# EAGLE schematic board (EAGLE 9.6.0)
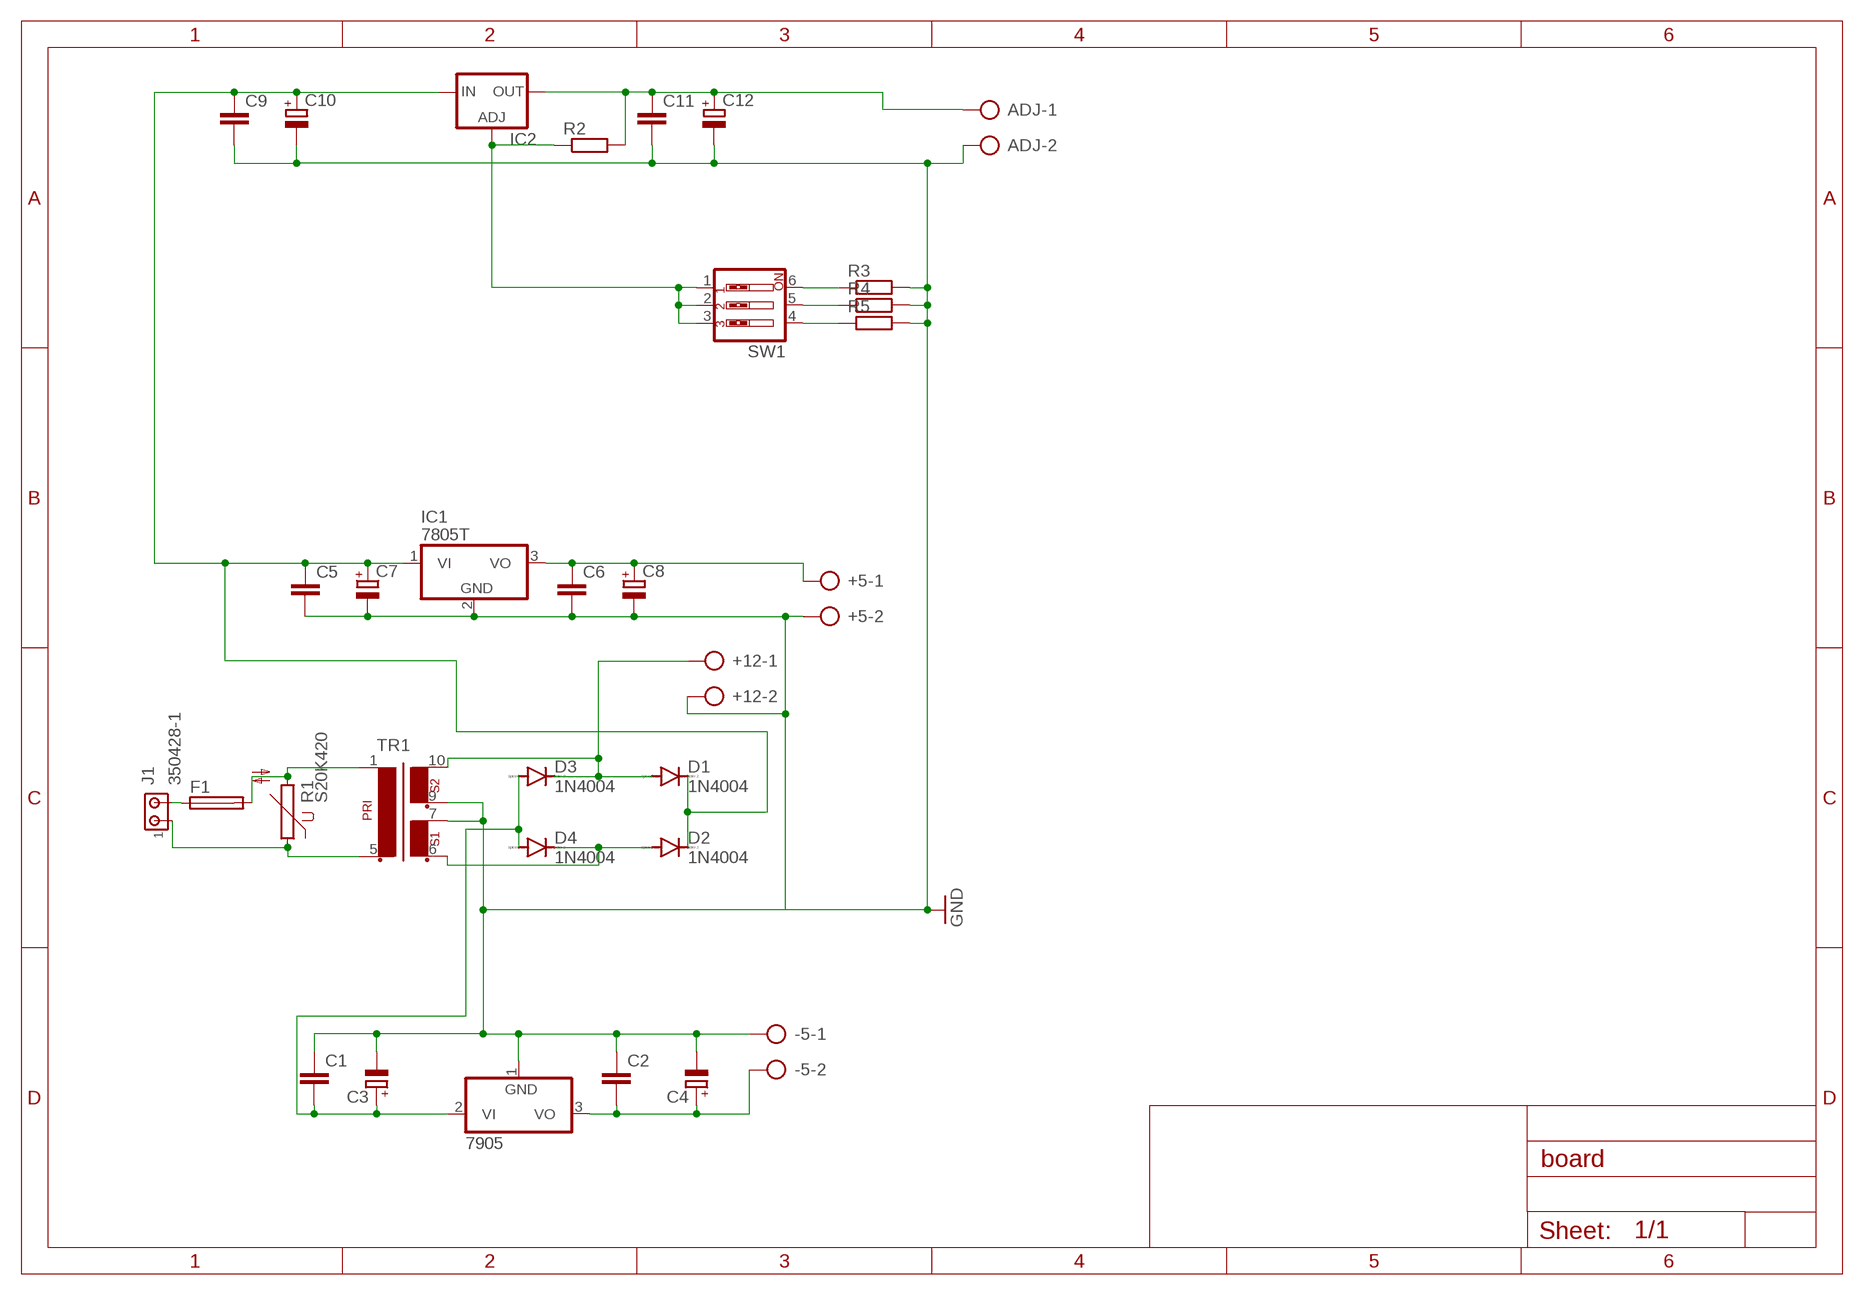
[diagram p0: schematic, sheet 1]

## Parts
7905  7905T  [TO220H]
+5  AK500/2-H  [AK500/2-H]
+12  AK500/2-H  [AK500/2-H]
-5  AK500/2-H  [AK500/2-H]
ADJ  AK500/2-H  [AK500/2-H]
C1  C-EU025-025X050  [C025-025X050]
C2  C-EU025-025X050  [C025-025X050]
C3  CPOL-EUE2,5-6E  [E2,5-6E]
C4  CPOL-EUE2,5-6E  [E2,5-6E]
C5  C-EU025-025X050  [C025-025X050]
C6  C-EU025-025X050  [C025-025X050]
C7  CPOL-EUE2,5-6E  [E2,5-6E]
C8  CPOL-EUE2,5-6E  [E2,5-6E]
C9  C-EU025-025X050  [C025-025X050]
C10  CPOL-EUE2,5-6E  [E2,5-6E]
C11  C-EU025-025X050  [C025-025X050]
C12  CPOL-EUE2,5-6E  [E2,5-6E]
D1  1N4004  [DO41-10]
D2  1N4004  [DO41-10]
D3  1N4004  [DO41-10]
D4  1N4004  [DO41-10]
F1  GSH15  [GSH15]
IC1  7805T  [TO220H]
IC2  LM317TL  [317TL]
J1  350428-1  [350428-1]
R1  S20K420  [S20K420]
R2  R-EU_0204/7  [0204/7]
R3  R-EU_0204/7  [0204/7]
R4  R-EU_0204/7  [0204/7]
R5  R-EU_0204/7  [0204/7]
SW1  SW_DIP-3  [EDG-03]
TR1  EI30-2  [EI30-2]

## Nets
GND [large]: 7905.1(GND) +5.2 +12.2 -5.1 ADJ.2 C1.1 C2.1 C3.- C4.- C5.2 C6.2 C7.- C8.- C9.2 C10.- C11.2 C12.- IC1.2(GND) R3.2 R4.2 R5.2 TR1.7 TR1.9
N$1 [large]: F1.1 J1.2
N$2 [large]: J1.1 R1.1 TR1.5
N$3 [large]: F1.2 R1.2 TR1.1
N$4 [large]: +12.1 D1.A D3.C TR1.10
N$5 [large]: R3.1 SW1.6
N$6 [large]: 7905.2(VI) C1.2 C3.+ D3.A D4.A
N$7 [large]: R4.1 SW1.5
N$8 [large]: 7905.3(VO) -5.2 C2.2 C4.+
N$9 [large]: +5.1 C6.1 C8.+ IC1.3(VO)
N$10 [large]: C5.1 C7.+ C9.1 C10.+ D1.C D2.C IC1.1(VI) IC2.3(IN)
N$11 [large]: ADJ.1 C11.1 C12.+ IC2.2(OUT) R2.2
N$12 [large]: D2.A D4.C TR1.6
N$13 [large]: IC2.1(ADJ) R2.1 SW1.1 SW1.2 SW1.3
N$14 [large]: R5.1 SW1.4

## Library data of the parts
7905 = linear:79*: Negative VOLTAGE REGULATOR
+5 +12 -5 ADJ = con-ptr500:AK500/2-H: CONNECTOR Aug. 2004 / PTR Meßtechnik: Die Bezeichnung der Serie AK505 wurde geändert. Es handelt sich hierbei um AK500 in horizontaler Ausführung.; OC_FARNELL: unknown; OC_NEWARK: unknown
C1 C2 C5 C6 C9 C11 = rcl:C-EU: CAPACITOR, European symbol; SPICEPREFIX: C
C3 C4 C7 C8 C10 C12 = rcl:CPOL-EU: POLARIZED CAPACITOR, European symbol; SPICEPREFIX: C
D1-D4 = diode:1N4004: DIODE general purpose rectifier, 1 A
F1 = fuse:GSH15: FUSE HOLDER grid 15mm, 19649 Wickmann; MPN: 64900001039; OC_FARNELL: 1271673; OC_NEWARK: 02P0318
IC1 = linear:78*: Positive VOLTAGE REGULATOR Source: http://cache.national.com/ds/LM/LM78L05.pdf http://www.fairchildsemi.com/ds/LM/LM7805.pdf
IC2 = v-reg:LM317TL: VOLTAGE REGULATOR
J1 = con-amp:350428-1: Universal MATE-N-LOK .250" Centerline, 600 V, 19 - 36 A max Source: http://catalog.tycoelectronics.com/ .. ENG_CD_350428_Y.pdf
R1 = varistor:S20K420: VARISTOR
R2-R5 = rcl:R-EU_: RESISTOR, European symbol; SPICEPREFIX: R
SW1 = special:SW_DIP-3: DIP SWITCH
TR1 = trafo:EI30-2: TRANSFORMER 1 primary winding, 2 secondary windings ERA

## Net classes
0 default: width 0.813 mm
1 large: width 0.813 mm